# Altium schematic sheet Sheet_运放.schdoc
size 289 x 144 mm
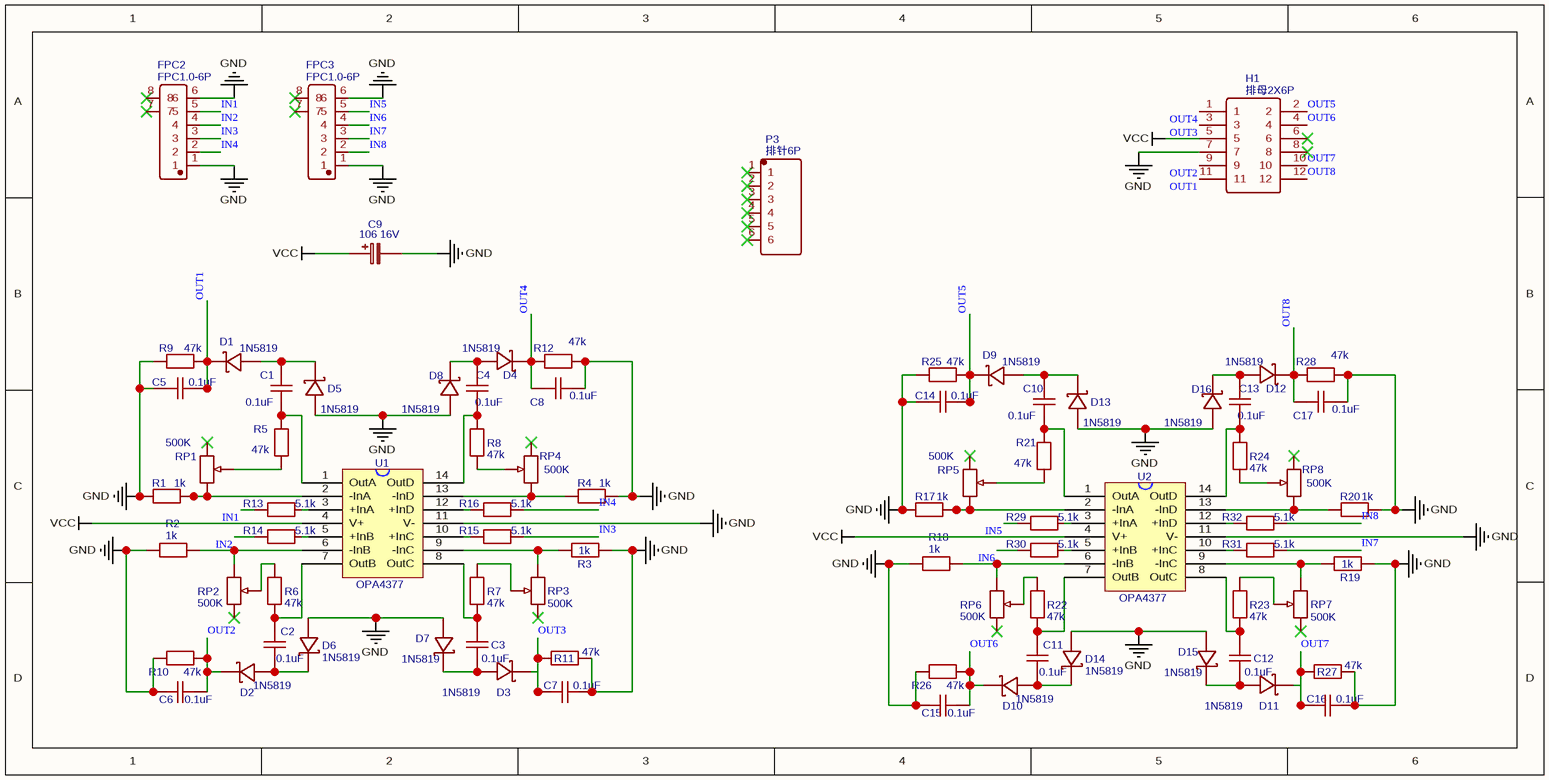
[diagram p0: Sheet_运放.schdoc]

## Parts
C1  0.1uF  [C0805]
C2  0.1uF  [C0805]
C3  0.1uF  [C0805]
C4  0.1uF  [C0805]
C5  0.1uF  [C0805]
C6  0.1uF  [C0805]
C7  0.1uF  [C0805]
C8  0.1uF  [C0805]
C9  106 16V  [CASE-A_3216]
C10  0.1uF  [C0805]
C11  0.1uF  [C0805]
C12  0.1uF  [C0805]
C13  0.1uF  [C0805]
C14  0.1uF  [C0805]
C15  0.1uF  [C0805]
C16  0.1uF  [C0805]
C17  0.1uF  [C0805]
D1  1N5819  [SOD-123FL_L2.7-W1.8-LS3.8-RD]
D2  1N5819  [SOD-123FL_L2.7-W1.8-LS3.8-RD]
D3  1N5819  [SOD-123FL_L2.7-W1.8-LS3.8-RD]
D4  1N5819  [SOD-123FL_L2.7-W1.8-LS3.8-RD]
D5  1N5819  [SOD-123FL_L2.7-W1.8-LS3.8-RD]
D6  1N5819  [SOD-123FL_L2.7-W1.8-LS3.8-RD]
D7  1N5819  [SOD-123FL_L2.7-W1.8-LS3.8-RD]
D8  1N5819  [SOD-123FL_L2.7-W1.8-LS3.8-RD]
D9  1N5819  [SOD-123FL_L2.7-W1.8-LS3.8-RD]
D10  1N5819  [SOD-123FL_L2.7-W1.8-LS3.8-RD]
D11  1N5819  [SOD-123FL_L2.7-W1.8-LS3.8-RD]
D12  1N5819  [SOD-123FL_L2.7-W1.8-LS3.8-RD]
D13  1N5819  [SOD-123FL_L2.7-W1.8-LS3.8-RD]
D14  1N5819  [SOD-123FL_L2.7-W1.8-LS3.8-RD]
D15  1N5819  [SOD-123FL_L2.7-W1.8-LS3.8-RD]
D16  1N5819  [SOD-123FL_L2.7-W1.8-LS3.8-RD]
FPC2  FPC1.0-6P  [FPC-SMD_8P-P1.00_FPC1.0-8P-SJ]
FPC3  FPC1.0-6P  [FPC-SMD_8P-P1.00_FPC1.0-8P-SJ]
H1  排母2X6P  [KY-排母2*6P间距2.54MM]
P3  排针6P  [排针6P]
R1  1k  [R0805]
R2  1k  [R0805]
R3  1k  [R0805]
R4  1k  [R0805]
R5  47k  [R0805]
R6  47k  [R0805]
R7  47k  [R0805]
R8  47k  [R0805]
R9  47k  [R0805]
R10  47k  [R0805]
R11  47k  [R0805]
R12  47k  [R0805]
R13  5.1k  [R0805]
R14  5.1k  [R0805]
R15  5.1k  [R0805]
R16  5.1k  [R0805]
R17  1k  [R0805]
R18  1k  [R0805]
R19  1k  [R0805]
R20  1k  [R0805]
R21  47k  [R0805]
R22  47k  [R0805]
R23  47k  [R0805]
R24  47k  [R0805]
R25  47k  [R0805]
R26  47k  [R0805]
R27  47k  [R0805]
R28  47k  [R0805]
R29  5.1k  [R0805]
R30  5.1k  [R0805]
R31  5.1k  [R0805]
R32  5.1k  [R0805]
RP1  500K  [RES-ADJ-TH_3P-L9.5-W4.85-P2.50-BL-BS]
RP2  500K  [RES-ADJ-TH_3P-L9.5-W4.85-P2.50-BL-BS]
RP3  500K  [RES-ADJ-TH_3P-L9.5-W4.85-P2.50-BL-BS]
RP4  500K  [RES-ADJ-TH_3P-L9.5-W4.85-P2.50-BL-BS]
RP5  500K  [RES-ADJ-TH_3P-L9.5-W4.85-P2.50-BL-BS]
RP6  500K  [RES-ADJ-TH_3P-L9.5-W4.85-P2.50-BL-BS]
RP7  500K  [RES-ADJ-TH_3P-L9.5-W4.85-P2.50-BL-BS]
RP8  500K  [RES-ADJ-TH_3P-L9.5-W4.85-P2.50-BL-BS]
U1  OPA4377  [OPA4377]
U2  OPA4377  [OPA4377]

## Nets
GND: C5.2 C6.2 C7.1 C8.1 C9.2 C14.2 C15.2 C16.1 C17.1 D5.1(A) D6.1(A) D7.1(A) D8.1(A) D13.1(A) D14.1(A) D15.1(A) D16.1(A) FPC2.1 FPC2.6 FPC3.1 FPC3.6 H1.7 R1.2 R2.1 R3.1 R4.1 R9.1 R10.1 R11.2 R12.2 R17.2 R18.1 R19.1 R20.1 R25.1 R26.1 R27.2 R28.2 U1.11(V-) U2.11(V-)
VCC: C9.1 H1.5 U1.4(V+) U2.4(V+)
IN1: FPC2.5 R13.1
IN2: FPC2.4 R14.1
IN3: FPC2.3 R15.2
IN4: FPC2.2 R16.2
IN5: FPC3.5 R29.1
IN6: FPC3.4 R30.1
IN7: FPC3.3 R31.2
IN8: FPC3.2 R32.2
OUT1: C5.1 D1.2(K) H1.11 R9.2
OUT2: C6.1 D2.2(K) H1.9 R10.2
OUT3: C7.2 D3.2(K) H1.3 R11.1
OUT4: C8.2 D4.2(K) H1.1 R12.1
OUT5: C14.1 D9.2(K) H1.2 R25.2
OUT6: C15.1 D10.2(K) H1.4 R26.2
OUT7: C16.2 D11.2(K) H1.10 R27.1
OUT8: C17.2 D12.2(K) H1.12 R28.1
NetC1_1: C1.1 R5.2 U1.1(OutA)
NetC1_2: C1.2 D1.1(A) D5.2(K)
NetC2_1: C2.1 D2.1(A) D6.2(K)
NetC2_2: C2.2 R6.1 U1.7(OutB)
NetC3_1: C3.1 D3.1(A) D7.2(K)
NetC3_2: C3.2 R7.1 U1.8(OutC)
NetC4_1: C4.1 R8.1 U1.14(OutD)
NetC4_2: C4.2 D4.1(A) D8.2(K)
NetC10_1: C10.1 R21.2 U2.1(OutA)
NetC10_2: C10.2 D9.1(A) D13.2(K)
NetC11_1: C11.1 D10.1(A) D14.2(K)
NetC11_2: C11.2 R22.1 U2.7(OutB)
NetC12_1: C12.1 D11.1(A) D15.2(K)
NetC12_2: C12.2 R23.1 U2.8(OutC)
NetC13_1: C13.1 R24.1 U2.14(OutD)
NetC13_2: C13.2 D12.1(A) D16.2(K)
NetR1_1: R1.1 RP1.3 U1.2(-InA)
NetR2_2: R2.2 RP2.1 U1.6(-InB)
NetR3_2: R3.2 RP3.3 U1.9(-InC)
NetR4_2: R4.2 RP4.1 U1.13(-InD)
NetR5_1: R5.1 RP1.2
NetR6_2: R6.2 RP2.2
NetR7_2: R7.2 RP3.2
NetR8_2: R8.2 RP4.2
NetR13_2: R13.2 U1.3(+InA)
NetR14_2: R14.2 U1.5(+InB)
NetR15_1: R15.1 U1.10(+InC)
NetR16_1: R16.1 U1.12(+InD)
NetR17_1: R17.1 RP5.3 U2.2(-InA)
NetR18_2: R18.2 RP6.1 U2.6(-InB)
NetR19_2: R19.2 RP7.3 U2.9(-InC)
NetR20_2: R20.2 RP8.1 U2.13(-InD)
NetR21_1: R21.1 RP5.2
NetR22_2: R22.2 RP6.2
NetR23_2: R23.2 RP7.2
NetR24_2: R24.2 RP8.2
NetR29_2: R29.2 U2.3(+InA)
NetR30_2: R30.2 U2.5(+InB)
NetR31_1: R31.1 U2.10(+InC)
NetR32_1: R32.1 U2.12(+InD)

Not connected (* = marked no-connect by the designer): FPC2 7* 8*; FPC3 7* 8*; H1 6* 8*; P3 1* 2* 3* 4* 5* 6*; RP1 1*; RP2 3*; RP3 1*; RP4 3*; RP5 1*; RP6 3*; RP7 1*; RP8 3*

## Library data of the parts
C1-C8 C10-C17 = 0.1uF: nameAlias: Value(F); Contributor: LCEDA_Lib; spicePre: C; spiceSymbolName: C_0805_US
C9 = 106 16V: nameAlias: Value(F); Contributor: LCEDA_Lib; spicePre: C; spiceSymbolName: C_Tan_SMD_A_EU
D1-D16 = 1N5819: Manufacturer: STMicroelectronics; Paste Type: expand; Supplier: LCSC; Manufacturer Part: 1N5819; Supplier Part: C110032; Assembly Type: manualWeld; spicePre: D; spiceSymbolName: 1N5819
FPC2 FPC3 = FPC1.0-6P: Manufacturer: Ckmtw; Manufacturer Part: FPC1.0-8P; Contributor: zjw101016; Supplier: LCSC; Supplier Part: C132510; JLCPCB Part Class: Extended Part; spicePre: F; spiceSymbolName: FPC1.0-6P
H1 = 排母2X6P: Manufacturer: Shenzhen Cankemeng; Contributor: keying; Supplier: LCSC; Supplier Part: C169818; Manufacturer Part: -; JLCPCB Part Class: Extended Part; spicePre: H; spiceSymbolName: 排母2X6P
P3 = 排针6P: Contributor: qq312022172; spicePre: P; spiceSymbolName: 排针6P
R1-R4 R17-R20 = 1k: nameAlias: Value(Ω); Contributor: LCEDA_Lib; spicePre: R; spiceSymbolName: R_0805_EU
R5-R12 R21-R28 = 47k: nameAlias: Value(Ω); Contributor: LCEDA_Lib; spicePre: R; spiceSymbolName: R_0805_EU
R13-R16 R29-R32 = 5.1k: nameAlias: Value(Ω); Contributor: LCEDA_Lib; spicePre: R; spiceSymbolName: R_0805_EU
RP1-RP8 = 500K: nameAlias: Resistance (Ohms); Contributor: LCEDA_Lib; Value(Ω): 10K; Supplier: LCSC; spicePre: R; spiceSymbolName: R_3386P_EU
U1 U2 = OPA4377: Contributor: Adventurex; spicePre: U; spiceSymbolName: OPA4377